# Altium schematic sheet BSU_ESD.SchDoc: ESD
size A4; Sub Team: EEE; Organization: PERT; SheetNumber: 6; SheetTotal: 8
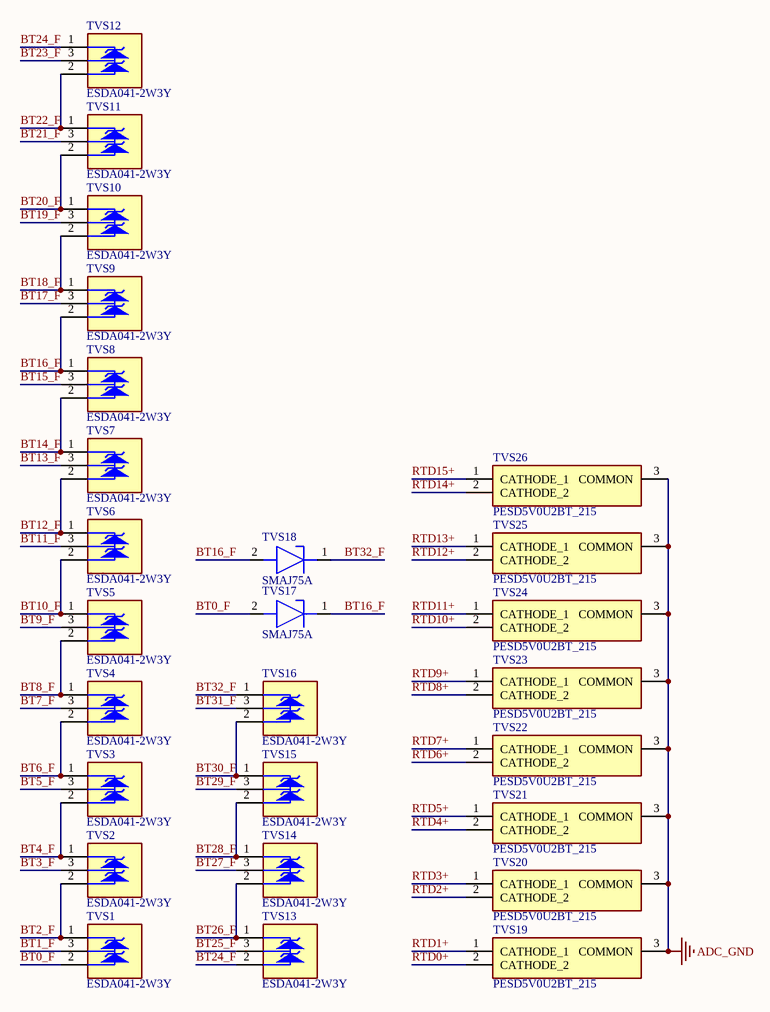
[diagram p0: BSU_ESD.SchDoc]

## Parts
TVS1  ESDA041-2W3Y  [SOT323-3_ESDA041-2W3Y]
TVS2  ESDA041-2W3Y  [SOT323-3_ESDA041-2W3Y]
TVS3  ESDA041-2W3Y  [SOT323-3_ESDA041-2W3Y]
TVS4  ESDA041-2W3Y  [SOT323-3_ESDA041-2W3Y]
TVS5  ESDA041-2W3Y  [SOT323-3_ESDA041-2W3Y]
TVS6  ESDA041-2W3Y  [SOT323-3_ESDA041-2W3Y]
TVS7  ESDA041-2W3Y  [SOT323-3_ESDA041-2W3Y]
TVS8  ESDA041-2W3Y  [SOT323-3_ESDA041-2W3Y]
TVS9  ESDA041-2W3Y  [SOT323-3_ESDA041-2W3Y]
TVS10  ESDA041-2W3Y  [SOT323-3_ESDA041-2W3Y]
TVS11  ESDA041-2W3Y  [SOT323-3_ESDA041-2W3Y]
TVS12  ESDA041-2W3Y  [SOT323-3_ESDA041-2W3Y]
TVS13  ESDA041-2W3Y  [SOT323-3_ESDA041-2W3Y]
TVS14  ESDA041-2W3Y  [SOT323-3_ESDA041-2W3Y]
TVS15  ESDA041-2W3Y  [SOT323-3_ESDA041-2W3Y]
TVS16  ESDA041-2W3Y  [SOT323-3_ESDA041-2W3Y]
TVS17  SMAJ75A  [SMA_SMAJ75A]
TVS18  SMAJ75A  [SMA_SMAJ75A]
TVS19  PESD5V0U2BT_215  [SOT23-3_PESD5V0U2BT]
TVS20  PESD5V0U2BT_215  [SOT23-3_PESD5V0U2BT]
TVS21  PESD5V0U2BT_215  [SOT23-3_PESD5V0U2BT]
TVS22  PESD5V0U2BT_215  [SOT23-3_PESD5V0U2BT]
TVS23  PESD5V0U2BT_215  [SOT23-3_PESD5V0U2BT]
TVS24  PESD5V0U2BT_215  [SOT23-3_PESD5V0U2BT]
TVS25  PESD5V0U2BT_215  [SOT23-3_PESD5V0U2BT]
TVS26  PESD5V0U2BT_215  [SOT23-3_PESD5V0U2BT]

## Nets
ADC_GND: TVS19.3(COMMON) TVS20.3(COMMON) TVS21.3(COMMON) TVS22.3(COMMON) TVS23.3(COMMON) TVS24.3(COMMON) TVS25.3(COMMON) TVS26.3(COMMON)
BT0_F: TVS1.2(A2) TVS17.2(A)
BT1_F: TVS1.3(A1_/K2)
BT2_F: TVS1.1(K1) TVS2.2(A2)
BT3_F: TVS2.3(A1_/K2)
BT4_F: TVS2.1(K1) TVS3.2(A2)
BT5_F: TVS3.3(A1_/K2)
BT6_F: TVS3.1(K1) TVS4.2(A2)
BT7_F: TVS4.3(A1_/K2)
BT8_F: TVS4.1(K1) TVS5.2(A2)
BT9_F: TVS5.3(A1_/K2)
BT10_F: TVS5.1(K1) TVS6.2(A2)
BT11_F: TVS6.3(A1_/K2)
BT12_F: TVS6.1(K1) TVS7.2(A2)
BT13_F: TVS7.3(A1_/K2)
BT14_F: TVS7.1(K1) TVS8.2(A2)
BT15_F: TVS8.3(A1_/K2)
BT16_F: TVS8.1(K1) TVS9.2(A2) TVS17.1(K) TVS18.2(A)
BT17_F: TVS9.3(A1_/K2)
BT18_F: TVS9.1(K1) TVS10.2(A2)
BT19_F: TVS10.3(A1_/K2)
BT20_F: TVS10.1(K1) TVS11.2(A2)
BT21_F: TVS11.3(A1_/K2)
BT22_F: TVS11.1(K1) TVS12.2(A2)
BT23_F: TVS12.3(A1_/K2)
BT24_F: TVS12.1(K1) TVS13.2(A2)
BT25_F: TVS13.3(A1_/K2)
BT26_F: TVS13.1(K1) TVS14.2(A2)
BT27_F: TVS14.3(A1_/K2)
BT28_F: TVS14.1(K1) TVS15.2(A2)
BT29_F: TVS15.3(A1_/K2)
BT30_F: TVS15.1(K1) TVS16.2(A2)
BT31_F: TVS16.3(A1_/K2)
BT32_F: TVS16.1(K1) TVS18.1(K)
RTD0+: TVS19.2(CATHODE_2)
RTD1+: TVS19.1(CATHODE_1)
RTD2+: TVS20.2(CATHODE_2)
RTD3+: TVS20.1(CATHODE_1)
RTD4+: TVS21.2(CATHODE_2)
RTD5+: TVS21.1(CATHODE_1)
RTD6+: TVS22.2(CATHODE_2)
RTD7+: TVS22.1(CATHODE_1)
RTD8+: TVS23.2(CATHODE_2)
RTD9+: TVS23.1(CATHODE_1)
RTD10+: TVS24.2(CATHODE_2)
RTD11+: TVS24.1(CATHODE_1)
RTD12+: TVS25.2(CATHODE_2)
RTD13+: TVS25.1(CATHODE_1)
RTD14+: TVS26.2(CATHODE_2)
RTD15+: TVS26.1(CATHODE_1)

## Notes on the sheet
- Title
- Generation
- Organization
- Sub Team
- Module
- Ver.
- Rev.
- Date
- Draw By

## Library data of the parts
TVS1-TVS16 = ESDA041-2W3Y: Automotive dual lines 4 V TVS for BMS in SOT323; Manufacturer_Name: STMicroelectronics; Geometry.Height: 1.1mm; Mouser Part Number: 511-ESDA041-2W3Y; Mouser Price/Stock: https://www.mouser.co.uk/ProductDetail/STMicroelectronics/ESDA041-2W3Y?qs=%252B6g0mu59x7IEynpxej3Q0w%3D%3D; Manufacturer_Part_Number: ESDA041-2W3Y; Datasheet Link: https://www.st.com/resource/en/datasheet/esda041-1jy.pdf
TVS17 TVS18 = SMAJ75A: LITTELFUSE - SMAJ75A - TVS Diode, SMAJ Series, Unidirectional, 75 V, 121 V, DO-214AC (SMA), 2 Pins; Geometry.Height: 2.29mm; Mouser Part Number: 576-SMAJ75A; Mouser Price/Stock: https://www.mouser.co.uk/ProductDetail/Littelfuse/SMAJ75A?qs=HR2RnyOI4E7Kp9oudr4VYA%3D%3D; Manufacturer_Name: LITTELFUSE; Manufacturer_Part_Number: SMAJ75A; Datasheet Link: https://altium.componentsearchengine.com/Datasheets/2/SMAJ75A.pdf
TVS19-TVS26 = PESD5V0U2BT_215: PESD5V0U2BT - Ultra low capacitance bidirectional double ESD protection diode; Manufacturer_Name: Nexperia; Manufacturer_Part_Number: PESD5V0U2BT,215; Geometry.Height: 1.1mm; Mouser Part Number: 771-PESD5V0U2BTT/R; Mouser Price/Stock: https://www.mouser.co.uk/ProductDetail/Nexperia/PESD5V0U2BT215?qs=LOCUfHb8d9uKnndgcTorSw%3D%3D; Datasheet Link: https://assets.nexperia.com/documents/data-sheet/PESD5V0U2BT.pdf